# EAGLE design EMG (EAGLE 8.5.1)
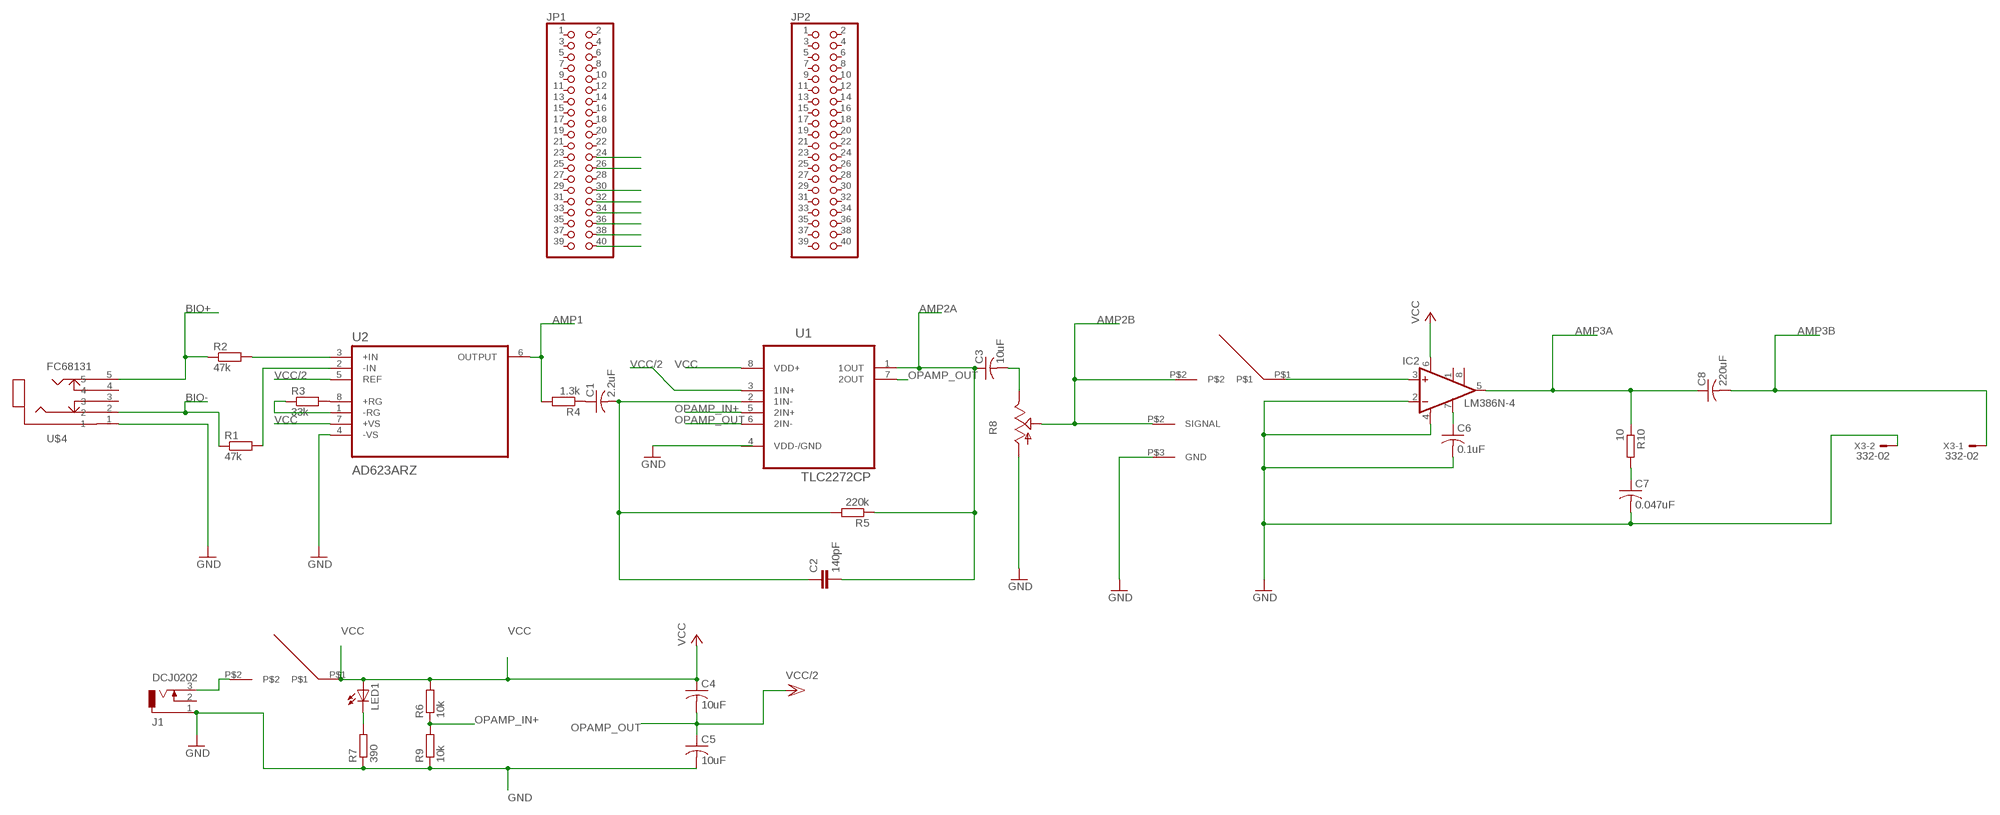
[diagram p0: schematic, sheet 1]

## Parts
C1  2.2uF  C-US025-025X050  [C025-025X050]
C2  140pF  C7.5/3  [C7.5B3]
C3  10uF  C-US025-025X050  [C025-025X050]
C4  10uF  C-US025-025X050  [C025-025X050]
C5  10uF  C-US025-025X050  [C025-025X050]
C6  0.1uF  C-US025-025X050  [C025-025X050]
C7  0.047uF  C-US050-030X075  [C050-030X075]
C8  220uF  C-US050-030X075  [C050-030X075]
IC2  LM386N-4  [DIL08]
J1  DCJ0202  [DCJ0202]
JP1  PINHD-2X20  [2X20]
JP2  PINHD-2X20  [2X20]
LED1  LED3MM  [LED3MM]
R1  47k  R-EU_0204/7  [0204/7]
R2  47k  R-EU_0204/7  [0204/7]
R3  33k  R-EU_0204/7  [0204/7]
R4  1.3k  R-EU_0204/7  [0204/7]
R5  220k  R-EU_0204/7  [0204/7]
R6  10k  R-EU_0204/7  [0204/7]
R7  390  R-EU_0204/7  [0204/7]
R8  TRIM_US-B25U  [B25U]
R9  10k  R-EU_0204/7  [0204/7]
R10  10  R-EU_0204/7  [0204/7]
U1  TLC2272CP  [DIP254P762X508-8]
U2  AD623ARZ  [SOIC127P600X175-8N]
U$1  CHL-706PG01LWB  [PUSH_BUTTON]
U$2  CHL-706PG01LWB  [PUSH_BUTTON]
U$3  1503_12_JACK_3,5  [1503_12_JACK_3,5]
U$4  FC68131  [FC68131-5P]
X3  332-02  [332-02]

## Nets
AMP1: JP1.34 R4.2 U2.6(OUTPUT)
AMP2A: C2.2 C3.1 JP1.36 R5.1 U1.1(1OUT)
AMP2B: JP1.38 R8.S U$2.P$2 U$3.P$2(SIGNAL)
AMP3A: C8.1 IC2.5(OUT) R10.1
AMP3B: C8.2 JP1.40 X3.1
BIO+: JP1.32 R2.1 U$4.5
BIO-: JP1.30 R1.1 U$4.2
GND: C5.2 C6.2 C7.2 IC2.2(-IN) IC2.4(GND) J1.1 JP1.24 R7.1 R8.A R9.1 U2.4(-VS) U$3.P$3(GND) U$4.1 X3.2
N$2: R3.2 U2.8(+RG)
N$3: R3.1 U2.1(-RG)
N$4: R2.2 U2.3(+IN)
N$5: R1.2 U2.2(-IN)
N$8: C1.1 R4.1
N$9: J1.3 U$1.P$2
N$10: C1.2 C2.1 R5.2 U1.2(1IN-)
N$13: C3.2 R8.E
N$15: C6.1 IC2.7(BYPASS)
N$16: IC2.3(+IN) U$2.P$1
N$19: LED1.K(C) R7.2
N$20: C7.1 R10.2
OPAMP_IN+: R6.1 R9.2 U1.5(2IN+)
OPAMP_OUT: C4.2 C5.1 U1.6(2IN-) U1.7(2OUT) ; supply symbol labelled VCC/2
VCC: C4.1 IC2.6(VS) JP1.26 LED1.A R6.2 U1.8(VDD+) U2.7(+VS) U$1.P$1
VCC/2: U1.3(1IN+) U2.5(REF)
Unconnected: IC2.1(GAIN) IC2.8(GAIN) J1.2 JP1.1 JP1.2 JP1.3 JP1.4 JP1.5 JP1.6 JP1.7 JP1.8 JP1.9 JP1.10 JP1.11 JP1.12 JP1.13 JP1.14 JP1.15 JP1.16 JP1.17 JP1.18 JP1.19 JP1.20 JP1.21 JP1.22 JP1.23 JP1.25 JP1.27 JP1.28 JP1.29 JP1.31 JP1.33 JP1.35 JP1.37 JP1.39 JP2.1 JP2.2 JP2.3 JP2.4 JP2.5 JP2.6 JP2.7 JP2.8 JP2.9 JP2.10 JP2.11 JP2.12 JP2.13 JP2.14 JP2.15 JP2.16 JP2.17 JP2.18 JP2.19 JP2.20 JP2.21 JP2.22 JP2.23 JP2.24 JP2.25 JP2.26 JP2.27 JP2.28 JP2.29 JP2.30 JP2.31 JP2.32 JP2.33 JP2.34 JP2.35 JP2.36 JP2.37 JP2.38 JP2.39 JP2.40 U1.4(VDD-/GND) U$4.3 U$4.4

## Library data of the parts
C1 C3-C6 = rcl:C-US: CAPACITOR, American symbol
C2 = capacitor-wima:C: CAPACITOR naming: grid - package width
C7 C8 = rcl:C-US: CAPACITOR, American symbol; SPICEPREFIX: C
IC2 = linear:LM386?-*: Low Voltage Audio Power Amplifier Source: http://cache.national.com/ds/LM/LM386.pdf
J1 = con-jack:DCJ0202: DC POWER JACK Source: DCJ0202.pdf; OC_FARNELL: unknown; OC_NEWARK: unknown
JP1 JP2 = pinhead:PINHD-2X20: PIN HEADER
LED1 = led:LED: LED OSRAM: - CHIPLED LG R971, LG N971, LY N971, LG Q971, LY Q971, LO R971, LY R971 LH N974, LH R974 LS Q976, LO Q976, LY Q976 LO Q996 - Hyper CHIPLED LW Q18S LB Q993, LB Q99A, LB R99A - SideLED LS A670, LO A670, LY A670, LG A670, LP A670 LB A673, LV A673, LT A673, LW A673 LH A674 LY A675 LS A676, LA A676, LO A676, LY A676, LW A676 LS A679, LY A679, LG A679 - Hyper Micro SIDELED® LS Y876, LA Y876, LO Y876, LY Y876 LT Y87S - SmartLED LW L88C, LW L88S LB L89C, LB L89S, LG L890 LS L89K, LO L89K, LY L89K LS L896, LA L896, LO L896, LY L896 - TOPLED LS T670, LO T670, LY T670, LG T670, LP T670 LSG T670, LSP T670, LSY T670, LOP T670, LYG T670 LG T671, LOG T671, LSG T671 LB T673, LV T673, LT T673, LW T673 LH T674 LS T676, LA T676, LO T676, LY T676, LB T676, LH T676, LSB T676, LW T676 LB T67C, LV T67C, LT T67C, LS T67K, LO T67K, LY T67K, LW E67C LS E67B, LA E67B, LO E67B, LY E67B, LB E67C, LV E67C, LT E67C LW T67C LS T679, LY T679, LG T679 LS T770, LO T770, LY T770, LG T770, LP T770 LB T773, LV T773, LT T773, LW T773 LH T774 LS E675, LA E675, LY E675, LS T675 LS T776, LA T776, LO T776, LY T776, LB T776 LHGB T686 LT T68C, LB T68C - Hyper Mini TOPLED® LB M676 - Mini TOPLED Santana® LG M470 LS M47K, LO M47K, LY M47K Source: http://www.osram.convergy.de LUXEON: - LUMILED® LXK2-PW12-R00, LXK2-PW12-S00, LXK2-PW14-U00, LXK2-PW14-V00 LXK2-PM12-R00, LXK2-PM12-S00, LXK2-PM14-U00 LXK2-PE12-Q00, LXK2-PE12-R00, LXK2-PE12-S00, LXK2-PE14-T00, LXK2-PE14-U00 LXK2-PB12-K00, LXK2-PB12-L00, LXK2-PB12-M00, LXK2-PB14-N00, LXK2-PB14-P00, LXK2-PB14-Q00 LXK2-PR12-L00, LXK2-PR12-M00, LXK2-PR14-Q00, LXK2-PR14-R00 LXK2-PD12-Q00, LXK2-PD12-R00, LXK2-PD12-S00 LXK2-PH12-R00, LXK2-PH12-S00 LXK2-PL12-P00, LXK2-PL12-Q00, LXK2-PL12-R00 Source: www.luxeon.com KINGBRIGHT: KA-3528ASYC Source: www.kingbright.com
R1-R7 R9 R10 = rcl:R-EU_: RESISTOR, European symbol
R8 = pot:TRIM_US-: POTENTIOMETER
U1 = TLC2272CP:TLC2272CP: OPERATIONAL AMPLIFIER; AVAILABILITY: Good; DESCRIPTION: Dual Low-Noise Rail-To-Rail Operational Amplifier 8-PDIP 0 to 70; MF: Texas Instruments; MP: TLC2272CP; PACKAGE: PDIP-8 Texas Instruments; PRICE: 1.52 USD
U2 = AD623ARZ:AD623ARZ: None; AVAILABILITY: Good; DESCRIPTION: SP Amp INSTR Amp Single R-R O/P ?6V/12V 8-Pin SOIC N Tube; MF: Analog Devices; MP: AD623ARZ; PACKAGE: SOIC-8 Analog Devices; PRICE: 3.43 USD
U$1 U$2 = EMG:CHL-706PG01LWB
U$3 = EMG:1503_12_JACK_3,5
U$4 = con-cliff:FC68131
X3 = con-garry:332-02: 2 Pin - 2mm Dual Row Source: www.mpe-connector.de / garry_shortform_2012.pdf

## Board
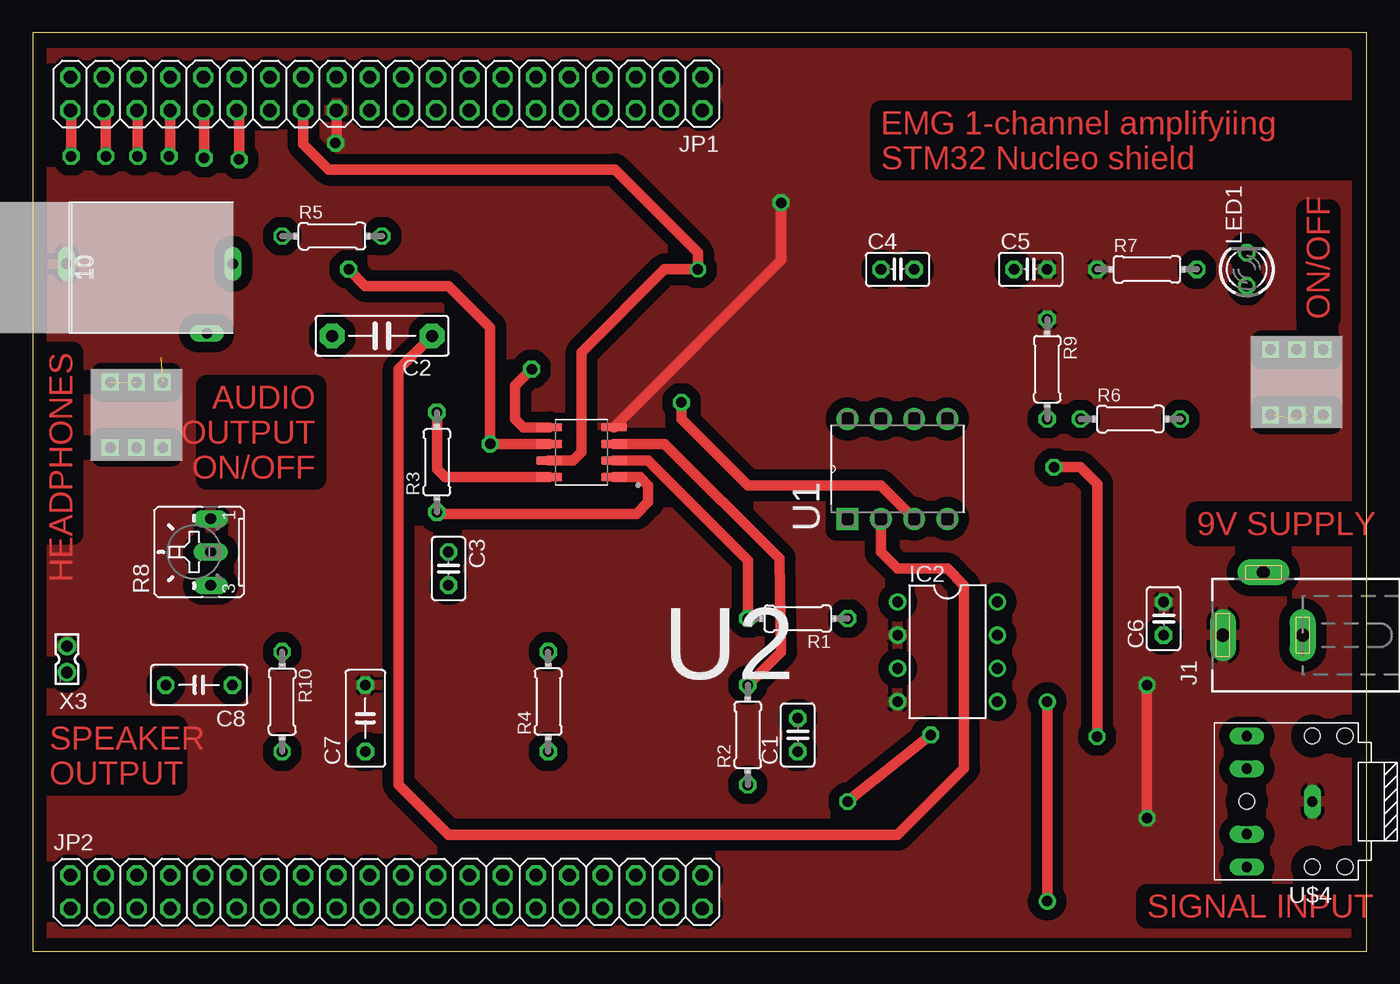
[diagram p1: board, top side]
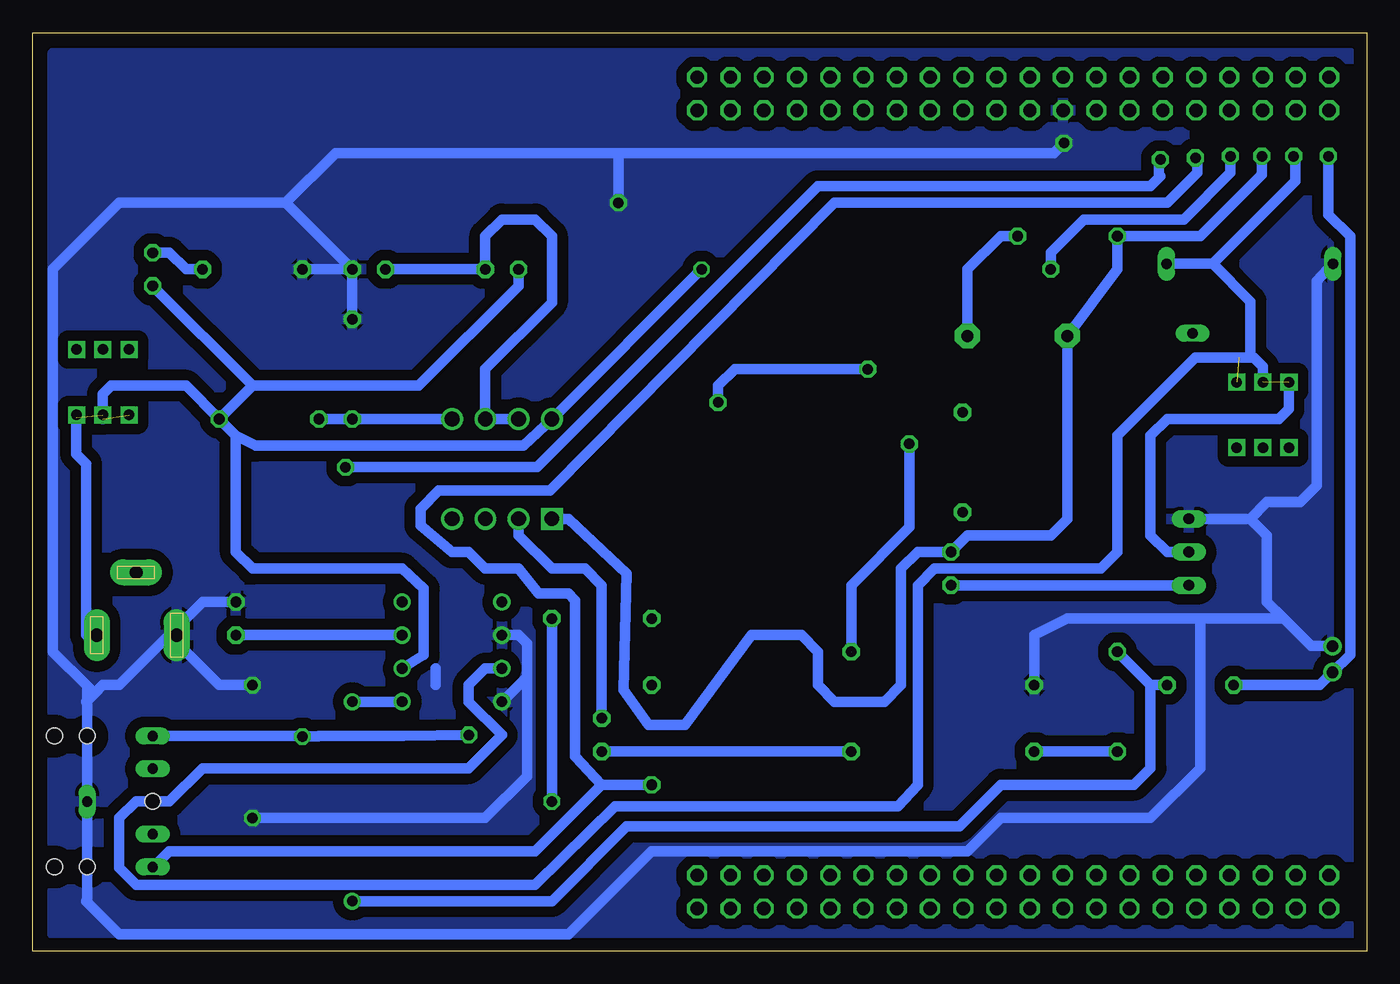
[diagram p2: board, bottom side, seen from below]

Size 101.87 x 70.14 mm. Coordinates in mm from the lower left corner, seen from the top.
Outline: 0,0 101.87,0 101.87,70.14 0,70.14 0,0
Copper layers (1*16): Top 0.035mm / dielectric 1.5mm / Bottom 0.035mm
Design rules "default *": minimum track width 10mil, minimum drill 24mil, track to track 10mil, track to pad 10mil, pad to pad 10mil, via to via 10mil, smd to smd 8mil, copper to edge 40mil, drill to drill 8mil, minimum pad ring 10mil, minimum via ring 8mil, stop-mask expansion 4mil, vias tented up to drill 0mil, thermal gap 10mil

### Footprints (pad centres in the part's own frame; a part is rotated, then mirrored left to right if it is on the bottom)
C025-025X050 = drill 0.813 octagon: 1 -1.27,0; 2 1.27,0
C7.5B3 = drill 0.914 pad 1.905 octagon: 1 -3.81,0; 2 3.81,0
C050-030X075 = drill 0.813 octagon: 1 -2.54,0; 2 2.54,0
DIL08 = drill 0.813 pad 1.27: 1 -3.81,-3.81; 2 -1.27,-3.81; 3 1.27,-3.81; 4 3.81,-3.81; 5 3.81,3.81; 6 1.27,3.81; 7 -1.27,3.81; 8 -3.81,3.81
DCJ0202 = drill 1 pad 2 long: 1 0,3.1; 2 4.8,0; 3 0,-3
2X20 = drill 1.016 octagon: 1 -24.13,-1.27; 2 -24.13,1.27; 3 -21.59,-1.27; 4 -21.59,1.27; 5 -19.05,-1.27; 6 -19.05,1.27; 7 -16.51,-1.27; 8 -16.51,1.27; 9 -13.97,-1.27; 10 -13.97,1.27; 11 -11.43,-1.27; 12 -11.43,1.27; 13 -8.89,-1.27; 14 -8.89,1.27; 15 -6.35,-1.27; 16 -6.35,1.27; 17 -3.81,-1.27; 18 -3.81,1.27; 19 -1.27,-1.27; 20 -1.27,1.27; 21 1.27,-1.27; 22 1.27,1.27; 23 3.81,-1.27; 24 3.81,1.27; 25 6.35,-1.27; 26 6.35,1.27; 27 8.89,-1.27; 28 8.89,1.27; 29 11.43,-1.27; 30 11.43,1.27; 31 13.97,-1.27; 32 13.97,1.27; 33 16.51,-1.27; 34 16.51,1.27; 35 19.05,-1.27; 36 19.05,1.27; 37 21.59,-1.27; 38 21.59,1.27; 39 24.13,-1.27; 40 24.13,1.27
LED3MM = drill 0.813 octagon: A -1.27,0; K 1.27,0
0204/7 = drill 0.813 octagon: 1 -3.81,0; 2 3.81,0
B25U = drill 0.813 long: A 2.54,-0.889; E -2.54,-0.889; S 0,-0.889
DIP254P762X508-8 = drill 1.118 square: 1 -7.62,7.62 | drill 1.118: 2 -7.62,5.08; 3 -7.62,2.54; 4 -7.62,0; 5 0,0; 6 0,2.54; 7 0,5.08; 8 0,7.62
SOIC127P600X175-8N = smd 1.97 x 0.6: 1 -2.475,1.905; 2 -2.475,0.635; 3 -2.475,-0.635; 4 -2.475,-1.905; 5 2.475,-1.905; 6 2.475,-0.635; 7 2.475,0.635; 8 2.475,1.905
PUSH_BUTTON = drill 0.8 square: P$1 1.5,1; P$2 3.5,1; P$3 5.5,1; P$4 1.5,6; P$5 3.5,6; P$6 5.5,6
1503_12_JACK_3,5 = drill 0.8 long: P$1 2,10; P$2 0,4.7; P$3 12.7,4.7
FC68131-5P = drill 0.8 long: 1 -5,0; 2 0,-5; 3 0,-2.5; 4 0,2.5; 5 0,5 | hole 1.2: 0,0; -5,-5; -5,5; -7.5,5; -7.5,-5
332-02 = drill 0.9 pad 1.27: 1 0,-1; 2 0,1

### Placement (x,y rotation side)
C1  58.42,16.51 90 top
C2  26.67,46.99 180 top
C3  31.75,29.21 270 top
C4  66.04,52.07 0 top
C5  76.2,52.07 0 top
C6  86.36,25.4 90 top
C7  25.4,17.78 90 top
C8  12.7,20.32 180 top
IC2  69.85,22.86 270 top
J1  93.98,24.13 90 top
JP1  27,65.48 180 top
JP2  27,4.52 0 top
LED1  92.71,52.07 90 top
R1  58.42,25.4 180 top
R2  54.61,16.51 90 top
R3  30.86,37.34 90 top
R4  39.37,19.05 90 top
R5  22.86,54.61 0 top
R6  83.82,40.64 0 top
R7  85.09,52.07 0 top
R8  12.7,30.48 90 top
R9  77.47,44.45 270 top
R10  19.05,19.05 270 top
U1  69.85,40.64 90 top
U2  41.91,38.1 180 top
U$1  93.01,39.95 0 top
U$2  11.43,44.45 180 top
U$3  15.29,57.19 180 top
U$4  92.71,11.43 180 top
X3  2.62,22.29 0 top

### Tracks (layer width: path | path; a pad name or v marks a point on that pad's centre or on a via)
AMP1  (via drill 0.8 pad 1.3)  (1 unrouted)
  Top 0.813: JP1.34 10.49,60.78 v10.41,60.71 | v24.13,52.07 25.4,50.8 31.75,50.8 34.92,47.62 v34.92,38.73 U2.6
  Bottom 0.813: v10.41,60.71 10.41,59.44 13.97,55.88 21.59,55.88 24.13,53.34 v24.13,52.07 | v34.92,38.73 34.92,32.38 39.37,27.94 R4.2 | R4.2
AMP2A  (via drill 0.8 pad 1.3)
  Top 0.813: v8,60.71 8,64.16 JP1.36
  Bottom 0.813: U1.1 60.96,33.02 56.52,28.83 56.77,19.94 54.86,17.27 52.07,17.27 46.99,24.13 43.18,24.13 41.91,22.86 41.91,20.32 40.64,19.05 36.83,19.05 35.56,20.32 35.56,29.21 34.29,30.48 C3.1 30.48,31.75 24.13,31.75 22.86,33.02 C2.2 19.05,52.07 R5.1 12.7,54.61 8,59.31 v8,60.71
AMP2B  (via drill 0.8 pad 1.3)  (1 unrouted)
  Top 0.813: v5.59,60.71 5.59,64.03 JP1.38
  Bottom 0.813: R8.S 15.24,30.48 16.51,31.75 16.51,39.37 15.24,40.64 6.73,40.64 5.97,41.4 5.97,43.43 | v5.59,60.71 5.46,60.58 5.46,58.8 11.77,52.49 | U$3.P$2 11.77,52.49 | U$2.P$2 7.93,44.63 8.64,45.34 8.89,45.34 | 8.89,45.34 10.16,45.34 | 11.77,52.49 8.89,49.61 8.89,45.34
AMP3A  (via drill 0.8 pad 1.3)
  Top 0.813: v77.47,3.81 v77.47,19.05
  Bottom 0.813: 16.51,20.32 16.51,13.97 17.78,12.7 27.94,12.7 31.11,9.53 56.52,9.53 62.23,3.81 v77.47,3.81 | 16.51,20.32 R10.1 | C8.1 16.51,20.32 | v77.47,19.05 IC2.5
AMP3B  (via drill 0.8 pad 1.3)
  Top 0.813: v2.92,60.71 2.92,64.16 JP1.40
  Bottom 0.813: C8.2 3.59,20.32 X3.1 1.27,22.64 1.27,54.61 2.92,56.26 v2.92,60.71
BIO+  (via drill 0.8 pad 1.3)
  Top 0.813: v13.08,60.58 13.08,64.16 JP1.32
  Bottom 0.813: R2.1 58.42,12.7 | 58.42,12.7 63.5,7.62 91.44,7.62 92.63,6.43 U$4.5 | 58.42,12.7 60.45,14.86 60.45,26.8 60.96,27.3 63.25,27.3 64.77,29.21 67.31,29.21 68.58,30.48 69.85,30.48 72.26,32.51 72.26,33.78 70.87,35.18 62.36,35.18 40.64,57.15 15.24,57.15 12.95,59.44 12.95,60.45 v13.08,60.58
BIO-  (via drill 0.8 pad 1.27, 0.8 pad 1.3)
  Top 0.813: v15.75,60.45 15.75,64.03 JP1.30 | v68.58,16.51 v62.23,11.43 | v81.28,16.38 81.28,35.69 80.01,36.96 v77.98,36.96
  Bottom 0.813: v77.98,36.96 63.37,36.96 41.91,58.42 16.51,58.42 15.88,59.05 | 15.88,59.05 15.75,59.18 | 15.88,59.05 15.88,60.33 v15.75,60.45 | v68.58,16.51 73.58,16.43 80.01,16.43 80.09,16.38 v81.28,16.38 81.33,16.43 U$4.2 | v62.23,11.43 R1.1
GND  (via drill 0.8 pad 1.27, 0.8 pad 1.3)
  Top 0.813: U2.4 57.15,52.77 v57.15,57.15 | JP1.24 23.19,61.8 v23.11,61.72 | v85.09,10.16 v85.09,20.32
  Bottom 0.813: C5.2 R7.1 | J1.1 90.88,24.69 88.9,26.67 C6.2 | X3.2 4.24,23.29 6.35,25.4 | 6.35,25.4 7.62,26.67 7.62,31.75 8.89,33.02 | 12.7,25.4 6.35,25.4 | R8.A 8.89,33.02 | 8.89,33.02 7.62,34.29 5.08,34.29 3.81,35.56 3.81,51.17 U$3.P$3 | 12.7,25.4 22.86,25.4 25.4,24.13 C7.2 | 12.7,25.4 12.7,13.97 16.51,10.16 27.94,10.16 30.48,7.62 54.61,7.62 60.96,1.27 95.25,1.27 97.79,3.81 97.71,3.89 U$4.1 97.71,20.24 | R9.1 C5.2 | J1.1 91.44,24.13 95.25,20.32 96.52,20.32 97.16,19.68 | 97.16,19.68 97.79,19.05 | C5.2 82.55,57.15 | 82.55,57.15 95.25,57.15 100.33,52.07 100.33,22.86 97.71,20.24 | 97.71,20.24 97.16,19.68 | v23.11,61.72 23.88,60.96 57.15,60.96 | 57.15,60.96 78.74,60.96 82.55,57.15 | 57.15,60.96 v57.15,57.15 | 71.12,21.59 71.12,20.32 | J1.1 90.88,23.57 87.63,20.32 v85.09,20.32 | IC2.2 64.77,24.13 64.14,23.5 64.14,20.95 | 64.14,20.95 IC2.4 | 64.14,20.95 64.14,13.34 67.31,10.16 v85.09,10.16
  pour Bottom (isolate 0.813): 1.27,68.58 100.33,68.58 100.33,1.27 1.27,1.27 1.27,67.31
  pour Top (isolate 0.813): 1.27,68.58 100.33,68.58 100.33,1.27 1.27,1.27
N$2
  Top 0.813: R3.2 30.86,36.83 31.5,36.2 U2.8
N$3
  Top 0.813: U2.1 46.35,36.2 46.99,35.56 46.99,34.29 46.1,33.4 30.99,33.4 R3.1
N$4
  Top 0.813: R2.2 57.15,22.86 57.02,29.97 48.26,38.73 U2.3
N$5
  Top 0.813: U2.2 46.99,37.47 54.61,29.84 R1.2
N$8
  Bottom 0.813: C1.1 R4.1
N$9  (1 unrouted)
  Bottom 0.813: J1.3 97.79,24.13 97.79,37.21 98.55,37.97 98.55,40.77
N$10
  Top 0.813: U1.2 64.77,30.48 66.04,29.21 69.85,29.21 71.12,27.94 71.12,13.97 66.04,8.89 31.75,8.89 27.94,12.7 27.94,44.45 C2.1
  Bottom 0.813: C1.2 58.42,27.94 59.69,29.21 62.23,29.21 64.77,31.75 U1.2 | R5.2 27.94,54.61 30.48,52.07 C2.1
N$13
  Bottom 0.813: R8.E C3.2
N$15
  Bottom 0.813: IC2.7 C6.1
N$16  (1 unrouted)
  Bottom 0.813: 9.78,45.34 13.08,45.34 19.05,39.37 19.05,30.48 20.32,29.21 33.02,29.21 34.29,27.94 34.29,12.7 35.81,11.05 57.4,11.05 63.5,5.08 93.98,5.08 95.25,6.35 95.25,10.16 93.98,11.43 91.44,11.43 88.9,13.97 68.58,13.97 66.04,16.51 68.58,19.05 68.58,20.32 67.31,21.59 IC2.3
N$19
  Bottom 0.813: LED1.K 91.44,53.34 90.17,52.07 R7.2
N$20
  Bottom 0.813: R10.2 C7.1
OPAMP_IN+
  Bottom 0.813: R6.1 R9.2 U1.5
OPAMP_OUT
  Bottom 0.813: C5.1 C4.2 67.31,54.61 66.04,55.88 63.5,55.88 62.23,54.61 62.23,49.53 67.31,44.45 U1.6 U1.7
VCC  (via drill 0.8 pad 1.15)  (1 unrouted)
  Top 0.813: U2.7 41.27,37.47 41.91,38.1 41.91,45.72 48.26,52.07 v50.8,52.07 50.8,53.34 44.45,59.69 22.61,59.69 20.65,61.65 JP1.26
  Bottom 0.813: IC2.6 72.01,22.61 72.01,27.69 73.66,29.21 85.09,29.21 86.36,30.48 86.36,39.37 | 86.36,39.37 R6.2 | v50.8,52.07 U1.8 64.39,38.61 84.84,38.61 86.36,39.37 | R6.2 85.09,43.18 | 85.09,43.18 72.39,43.18 64.77,50.8 C4.1 | LED1.A 85.09,43.18 | R6.2 90.17,43.18 93.98,43.18 95.89,43.18 96.52,42.55 96.52,40.64
VCC/2  (via drill 0.8 pad 1.3)
  Top 0.813: U1.3 64.77,35.56 54.61,35.56 49.53,40.64 v49.53,41.91 | v38.1,44.45 36.83,43.18 36.83,40.64 37.47,40.01 U2.5
  Bottom 0.813: v49.53,41.91 49.53,43.18 48.26,44.45 v38.1,44.45

### Text on the board
Top: EMG 1-channel amplifyiing / STM32 Nucleo shield | ON/OFF | HEADPHONES | AUDIO / OUTPUT / ON/OFF | 9V SUPPLY | SPEAKER / OUTPUT | SIGNAL INPUT